# EAGLE schematic HSI-interface-1 (EAGLE 7.6.0)

## Sheet 1 of 3
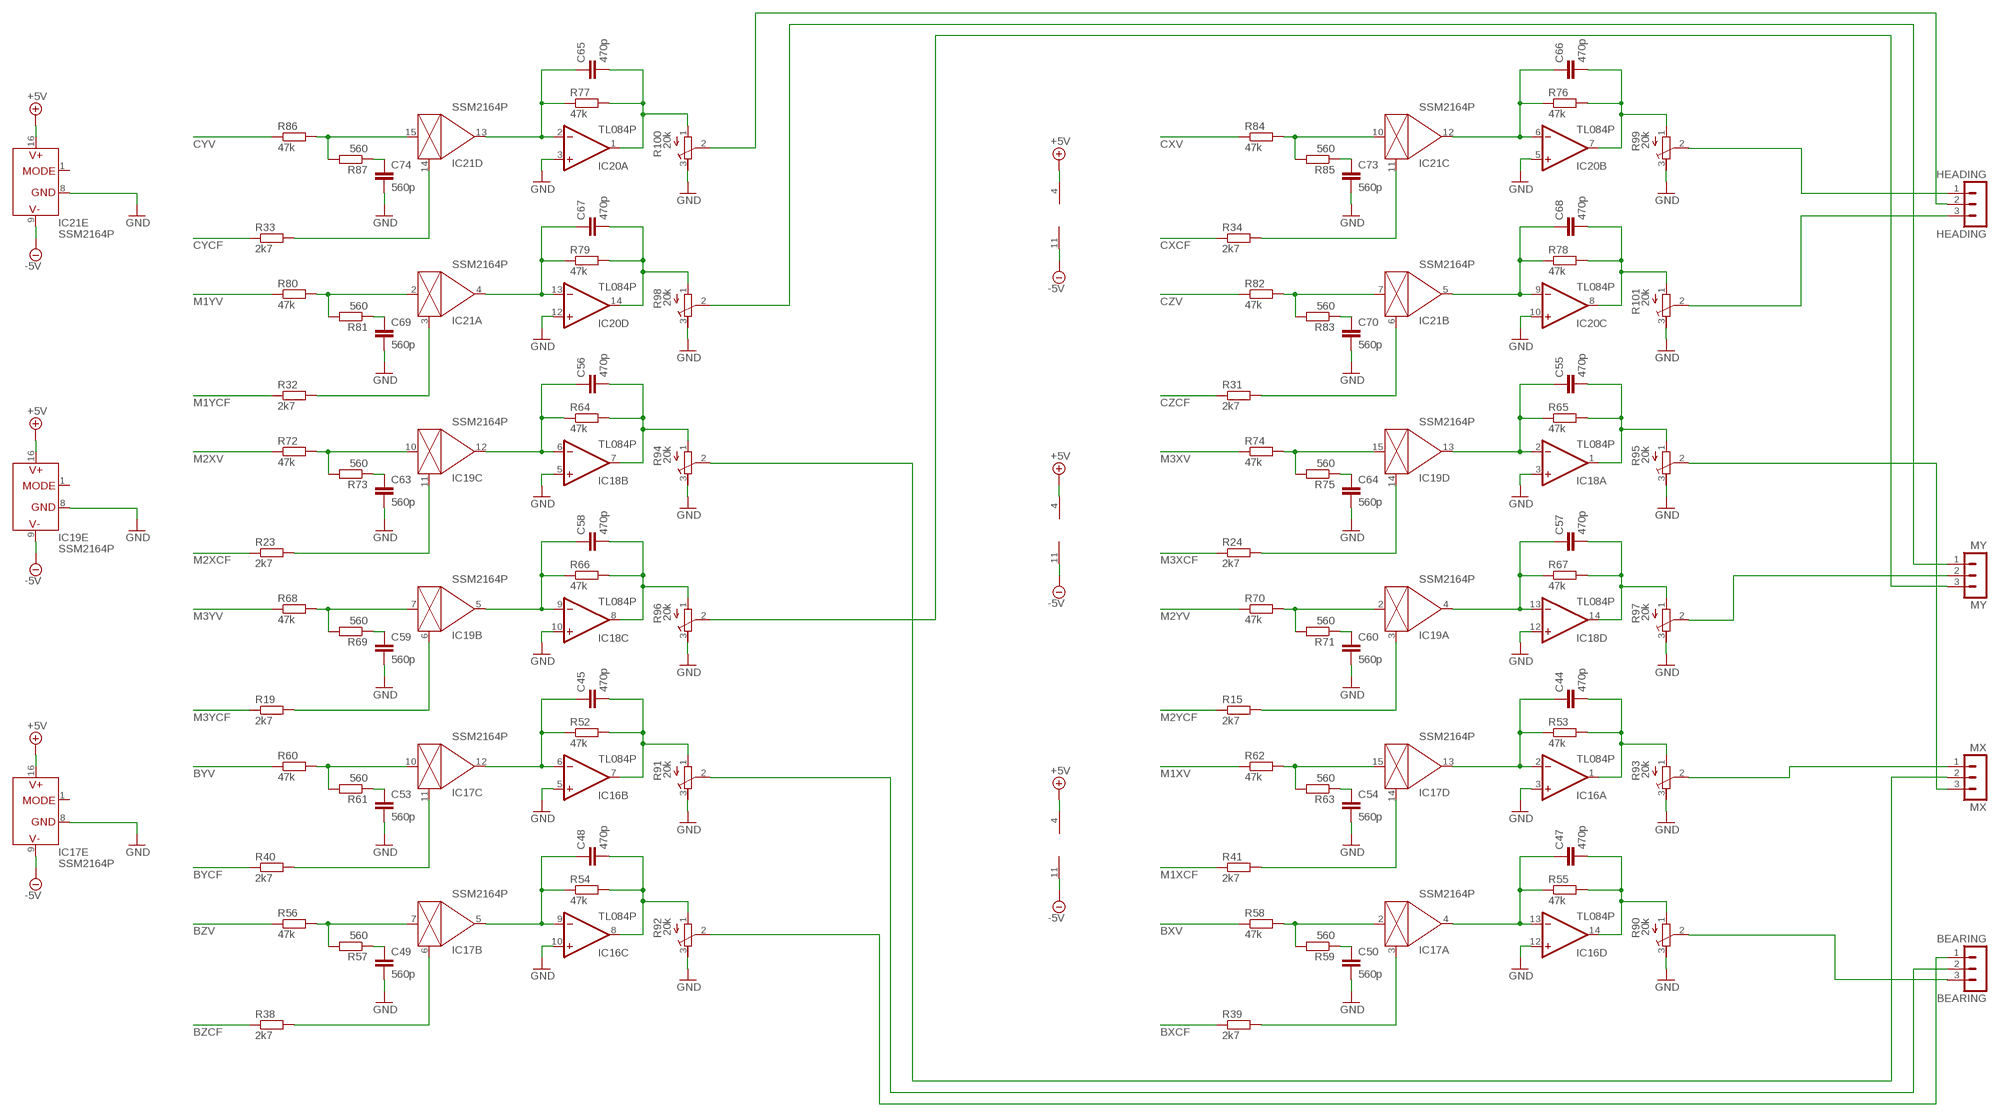
[diagram p0: schematic, sheet 1]

### Parts
BEARING  BEARING  MA03-1  [MA03-1]
C44  470p  C-EU025-025X050  [C025-025X050]
C45  470p  C-EU025-025X050  [C025-025X050]
C47  470p  C-EU025-025X050  [C025-025X050]
C48  470p  C-EU025-025X050  [C025-025X050]
C49  560p  C-EU025-025X050  [C025-025X050]
C50  560p  C-EU025-025X050  [C025-025X050]
C53  560p  C-EU025-025X050  [C025-025X050]
C54  560p  C-EU025-025X050  [C025-025X050]
C55  470p  C-EU025-025X050  [C025-025X050]
C56  470p  C-EU025-025X050  [C025-025X050]
C57  470p  C-EU025-025X050  [C025-025X050]
C58  470p  C-EU025-025X050  [C025-025X050]
C59  560p  C-EU025-025X050  [C025-025X050]
C60  560p  C-EU025-025X050  [C025-025X050]
C63  560p  C-EU025-025X050  [C025-025X050]
C64  560p  C-EU025-025X050  [C025-025X050]
C65  470p  C-EU025-025X050  [C025-025X050]
C66  470p  C-EU025-025X050  [C025-025X050]
C67  470p  C-EU025-025X050  [C025-025X050]
C68  470p  C-EU025-025X050  [C025-025X050]
C69  560p  C-EU025-025X050  [C025-025X050]
C70  560p  C-EU025-025X050  [C025-025X050]
C73  560p  C-EU025-025X050  [C025-025X050]
C74  560p  C-EU025-025X050  [C025-025X050]
HEADING  HEADING  MA03-1  [MA03-1]
IC16  TL084P  [DIL14]
IC17  SSM2164P  [DIL16]
IC18  TL084P  [DIL14]
IC19  SSM2164P  [DIL16]
IC20  TL084P  [DIL14]
IC21  SSM2164P  [DIL16]
MX  MX  MA03-1  [MA03-1]
MY  MY  MA03-1  [MA03-1]
R15  2k7  R-EU_0207/7  [0207/7]
R19  2k7  R-EU_0207/7  [0207/7]
R23  2k7  R-EU_0207/7  [0207/7]
R24  2k7  R-EU_0207/7  [0207/7]
R31  2k7  R-EU_0207/7  [0207/7]
R32  2k7  R-EU_0207/7  [0207/7]
R33  2k7  R-EU_0207/7  [0207/7]
R34  2k7  R-EU_0207/7  [0207/7]
R38  2k7  R-EU_0207/7  [0207/7]
R39  2k7  R-EU_0207/7  [0207/7]
R40  2k7  R-EU_0207/7  [0207/7]
R41  2k7  R-EU_0207/7  [0207/7]
R52  47k  R-EU_0207/7  [0207/7]
R53  47k  R-EU_0207/7  [0207/7]
R54  47k  R-EU_0207/7  [0207/7]
R55  47k  R-EU_0207/7  [0207/7]
R56  47k  R-EU_0207/7  [0207/7]
R57  560  R-EU_0207/7  [0207/7]
R58  47k  R-EU_0207/7  [0207/7]
R59  560  R-EU_0207/7  [0207/7]
R60  47k  R-EU_0207/7  [0207/7]
R61  560  R-EU_0207/7  [0207/7]
R62  47k  R-EU_0207/7  [0207/7]
R63  560  R-EU_0207/7  [0207/7]
R64  47k  R-EU_0207/7  [0207/7]
R65  47k  R-EU_0207/7  [0207/7]
R66  47k  R-EU_0207/7  [0207/7]
R67  47k  R-EU_0207/7  [0207/7]
R68  47k  R-EU_0207/7  [0207/7]
R69  560  R-EU_0207/7  [0207/7]
R70  47k  R-EU_0207/7  [0207/7]
R71  560  R-EU_0207/7  [0207/7]
R72  47k  R-EU_0207/7  [0207/7]
R73  560  R-EU_0207/7  [0207/7]
R74  47k  R-EU_0207/7  [0207/7]
R75  560  R-EU_0207/7  [0207/7]
R76  47k  R-EU_0207/7  [0207/7]
R77  47k  R-EU_0207/7  [0207/7]
R78  47k  R-EU_0207/7  [0207/7]
R79  47k  R-EU_0207/7  [0207/7]
R80  47k  R-EU_0207/7  [0207/7]
R81  560  R-EU_0207/7  [0207/7]
R82  47k  R-EU_0207/7  [0207/7]
R83  560  R-EU_0207/7  [0207/7]
R84  47k  R-EU_0207/7  [0207/7]
R85  560  R-EU_0207/7  [0207/7]
R86  47k  R-EU_0207/7  [0207/7]
R87  560  R-EU_0207/7  [0207/7]
R90  20k  R-TRIMM64Z  [RTRIM64Z]
R91  20k  R-TRIMM64Z  [RTRIM64Z]
R92  20k  R-TRIMM64Z  [RTRIM64Z]
R93  20k  R-TRIMM64Z  [RTRIM64Z]
R94  20k  R-TRIMM64Z  [RTRIM64Z]
R95  20k  R-TRIMM64Z  [RTRIM64Z]
R96  20k  R-TRIMM64Z  [RTRIM64Z]
R97  20k  R-TRIMM64Z  [RTRIM64Z]
R98  20k  R-TRIMM64Z  [RTRIM64Z]
R99  20k  R-TRIMM64Z  [RTRIM64Z]
R100  20k  R-TRIMM64Z  [RTRIM64Z]
R101  20k  R-TRIMM64Z  [RTRIM64Z]

### Nets
+5V [+5V]: IC16.4(P:V+) IC17.16(E:V+) IC18.4(P:V+) IC19.16(E:V+) IC20.4(P:V+) IC21.16(E:V+) ; also sheet 2,3
-5V [-5V]: IC16.11(P:V-) IC17.9(E:V-) IC18.11(P:V-) IC19.9(E:V-) IC20.11(P:V-) IC21.9(E:V-) ; also sheet 2,3
BXCF: R39.1 ; also sheet 3
BXV: R58.1 ; also sheet 2
BYCF: R40.1 ; also sheet 3
BYV: R60.1 ; also sheet 2
BZCF: R38.1 ; also sheet 3
BZV: R56.1 ; also sheet 2
CXCF: R34.1 ; also sheet 3
CXV: R84.1 ; also sheet 2
CYCF: R33.1 ; also sheet 3
CYV: R86.1 ; also sheet 2
CZCF: R31.1 ; also sheet 3
CZV: R82.1 ; also sheet 2
GND [ground]: C49.2 C50.2 C53.2 C54.2 C59.2 C60.2 C63.2 C64.2 C69.2 C70.2 C73.2 C74.2 IC16.3(A:+IN) IC16.5(B:+IN) IC16.10(C:+IN) IC16.12(D:+IN) IC17.8(E:GND) IC18.3(A:+IN) IC18.5(B:+IN) IC18.10(C:+IN) IC18.12(D:+IN) IC19.8(E:GND) IC20.3(A:+IN) IC20.5(B:+IN) IC20.10(C:+IN) IC20.12(D:+IN) IC21.8(E:GND) R90.3(A) R91.3(A) R92.3(A) R93.3(A) R94.3(A) R95.3(A) R96.3(A) R97.3(A) R98.3(A) R99.3(A) R100.3(A) R101.3(A) ; also sheet 2,3
M1XCF: R41.1 ; also sheet 3
M1XV: R62.1 ; also sheet 2
M1YCF: R32.1 ; also sheet 3
M1YV: R80.1 ; also sheet 2
M2XCF: R23.1 ; also sheet 3
M2XV: R72.1 ; also sheet 2
M2YCF: R15.1 ; also sheet 3
M2YV: R70.1 ; also sheet 2
M3XCF: R24.1 ; also sheet 3
M3XV: R74.1 ; also sheet 2
M3YCF: R19.1 ; also sheet 3
M3YV: R68.1 ; also sheet 2
N$4: IC21.3(A:CTRL) R32.2
N$8: IC21.14(D:CTRL) R33.2
N$12: IC19.11(C:CTRL) R23.2
N$16: IC19.6(B:CTRL) R19.2
N$20: IC17.11(C:CTRL) R40.2
N$24: IC17.6(B:CTRL) R38.2
N$28: IC21.11(C:CTRL) R34.2
N$32: IC21.6(B:CTRL) R31.2
N$36: IC19.14(D:CTRL) R24.2
N$40: IC19.3(A:CTRL) R15.2
N$44: IC17.14(D:CTRL) R41.2
N$48: IC17.3(A:CTRL) R39.2
N$49: IC21.10(C:IN) R84.2 R85.2
N$50: C73.1 R85.1
N$51: IC21.15(D:IN) R86.2 R87.2
N$52: C74.1 R87.1
N$53: IC21.7(B:IN) R82.2 R83.2
N$54: C70.1 R83.1
N$55: IC21.2(A:IN) R80.2 R81.2
N$56: C69.1 R81.1
N$57: C67.1 IC20.13(D:-IN) IC21.4(A:OUT) R79.1
N$59: C65.1 IC20.2(A:-IN) IC21.13(D:OUT) R77.1
N$62: C66.1 IC20.6(B:-IN) IC21.12(C:OUT) R76.1
N$63: C68.1 IC20.9(C:-IN) IC21.5(B:OUT) R78.1
N$64: C66.2 IC20.7(B:OUT) R76.2 R99.1(E)
N$65: C65.2 IC20.1(A:OUT) R77.2 R100.1(E)
N$66: C68.2 IC20.8(C:OUT) R78.2 R101.1(E)
N$67: C67.2 IC20.14(D:OUT) R79.2 R98.1(E)
N$68: IC19.10(C:IN) R72.2 R73.2
N$69: C63.1 R73.1
N$70: IC19.15(D:IN) R74.2 R75.2
N$71: C64.1 R75.1
N$72: IC19.2(A:IN) R70.2 R71.2
N$73: C60.1 R71.1
N$74: IC19.7(B:IN) R68.2 R69.2
N$75: C59.1 R69.1
N$76: C57.1 IC18.13(D:-IN) IC19.4(A:OUT) R67.1
N$77: C58.1 IC18.9(C:-IN) IC19.5(B:OUT) R66.1
N$78: C55.1 IC18.2(A:-IN) IC19.13(D:OUT) R65.1
N$79: C56.1 IC18.6(B:-IN) IC19.12(C:OUT) R64.1
N$80: C58.2 IC18.8(C:OUT) R66.2 R96.1(E)
N$81: C57.2 IC18.14(D:OUT) R67.2 R97.1(E)
N$82: C56.2 IC18.7(B:OUT) R64.2 R94.1(E)
N$83: C55.2 IC18.1(A:OUT) R65.2 R95.1(E)
N$103: HEADING.1 R99.2(S)
N$104: HEADING.3 R101.2(S)
N$105: HEADING.2 R100.2(S)
N$107: MY.1 R98.2(S)
N$110: MY.3 R96.2(S)
N$111: MY.2 R97.2(S)
N$113: MX.3 R95.2(S)
N$119: MX.2 R94.2(S)
N$120: IC17.10(C:IN) R60.2 R61.2
N$121: C53.1 R61.1
N$122: IC17.15(D:IN) R62.2 R63.2
N$123: C54.1 R63.1
N$124: IC17.2(A:IN) R58.2 R59.2
N$125: C50.1 R59.1
N$126: IC17.7(B:IN) R56.2 R57.2
N$127: C49.1 R57.1
N$130: C44.1 IC16.2(A:-IN) IC17.13(D:OUT) R53.1
N$131: C47.1 IC16.13(D:-IN) IC17.4(A:OUT) R55.1
N$133: MX.1 R93.2(S)
N$134: C45.1 IC16.6(B:-IN) IC17.12(C:OUT) R52.1
N$135: C48.1 IC16.9(C:-IN) IC17.5(B:OUT) R54.1
N$136: C45.2 IC16.7(B:OUT) R52.2 R91.1(E)
N$137: C44.2 IC16.1(A:OUT) R53.2 R93.1(E)
N$138: C48.2 IC16.8(C:OUT) R54.2 R92.1(E)
N$139: C47.2 IC16.14(D:OUT) R55.2 R90.1(E)
N$140: BEARING.3 R90.2(S)
N$144: BEARING.1 R92.2(S)
N$147: BEARING.2 R91.2(S)
Unconnected: IC17.1(E:MODE) IC19.1(E:MODE) IC21.1(E:MODE)

## Sheet 2 of 3
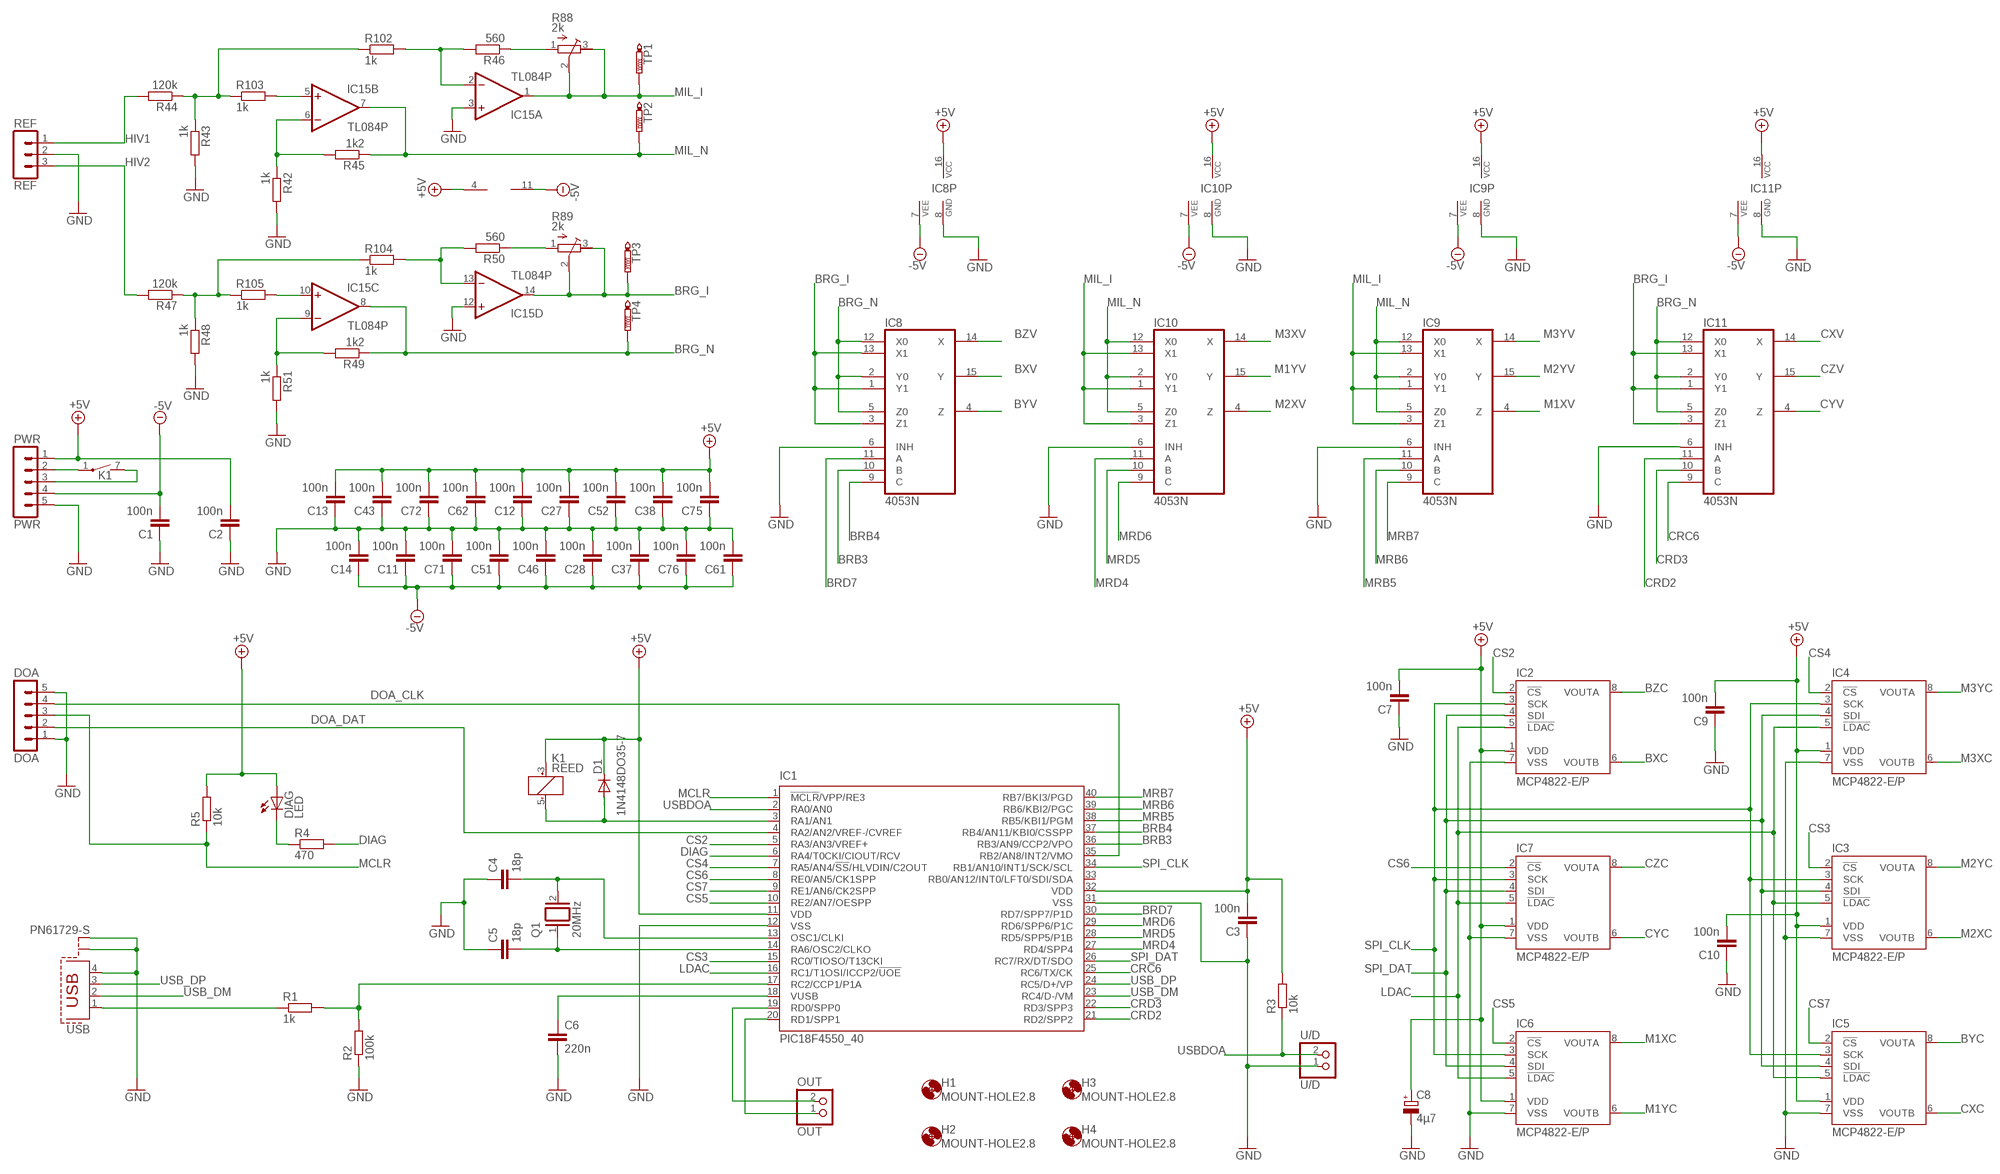
[diagram p1: schematic, sheet 2]

### Parts
C1  100n  C-EU025-025X050  [C025-025X050]
C2  100n  C-EU025-025X050  [C025-025X050]
C3  100n  C-EU025-025X050  [C025-025X050]
C4  18p  C-EU025-025X050  [C025-025X050]
C5  18p  C-EU025-025X050  [C025-025X050]
C6  220n  C5/3  [C5B3]
C7  100n  C-EU025-025X050  [C025-025X050]
C8  4µ7  CPOL-EUE2.5-5  [E2,5-5]
C9  100n  C-EU025-025X050  [C025-025X050]
C10  100n  C-EU025-025X050  [C025-025X050]
C11  100n  C-EU025-025X050  [C025-025X050]
C12  100n  C-EU025-025X050  [C025-025X050]
C13  100n  C-EU025-025X050  [C025-025X050]
C14  100n  C-EU025-025X050  [C025-025X050]
C27  100n  C-EU025-025X050  [C025-025X050]
C28  100n  C-EU025-025X050  [C025-025X050]
C37  100n  C-EU025-025X050  [C025-025X050]
C38  100n  C-EU025-025X050  [C025-025X050]
C43  100n  C-EU025-025X050  [C025-025X050]
C46  100n  C-EU025-025X050  [C025-025X050]
C51  100n  C-EU025-025X050  [C025-025X050]
C52  100n  C-EU025-025X050  [C025-025X050]
C61  100n  C-EU025-025X050  [C025-025X050]
C62  100n  C-EU025-025X050  [C025-025X050]
C71  100n  C-EU025-025X050  [C025-025X050]
C72  100n  C-EU025-025X050  [C025-025X050]
C75  100n  C-EU025-025X050  [C025-025X050]
C76  100n  C-EU025-025X050  [C025-025X050]
D1  1N4148DO35-7  [DO35-7]
DIAG  LED  LED3MM  [LED3MM]
DOA  DOA  MA05-1  [MA05-1]
H1  MOUNT-HOLE2.8  [2,8]
H2  MOUNT-HOLE2.8  [2,8]
H3  MOUNT-HOLE2.8  [2,8]
H4  MOUNT-HOLE2.8  [2,8]
IC1  PIC18F4550_40  [DIL40]
IC2  MCP4822-E/P  [DIL08]
IC3  MCP4822-E/P  [DIL08]
IC4  MCP4822-E/P  [DIL08]
IC5  MCP4822-E/P  [DIL08]
IC6  MCP4822-E/P  [DIL08]
IC7  MCP4822-E/P  [DIL08]
IC8  4053N  [DIL16]
IC9  4053N  [DIL16]
IC10  4053N  [DIL16]
IC11  4053N  [DIL16]
IC15  TL084P  [DIL14]
K1  REED  [REED]
OUT  OUT  PINHD-1X2  [1X02]
PWR  PWR  MA05-1  [MA05-1]
Q1  20MHz  XTAL/S  [QS]
R1  1k  R-EU_0204/7  [0204/7]
R2  100k  R-EU_0204/7  [0204/7]
R3  10k  R-EU_0204/7  [0204/7]
R4  470  R-EU_0204/7  [0204/7]
R5  10k  R-EU_0204/7  [0204/7]
R42  1k  R-EU_0204/7  [0204/7]
R43  1k  R-EU_0204/7  [0204/7]
R44  120k  R-EU_0204/7  [0204/7]
R45  1k2  R-EU_0204/7  [0204/7]
R46  560  R-EU_0204/7  [0204/7]
R47  120k  R-EU_0204/7  [0204/7]
R48  1k  R-EU_0204/7  [0204/7]
R49  1k2  R-EU_0204/7  [0204/7]
R50  560  R-EU_0204/7  [0204/7]
R51  1k  R-EU_0204/7  [0204/7]
R88  2k  R-TRIMM64Z  [RTRIM64Z]
R89  2k  R-TRIMM64Z  [RTRIM64Z]
R102  1k  R-EU_0204/7  [0204/7]
R103  1k  R-EU_0204/7  [0204/7]
R104  1k  R-EU_0204/7  [0204/7]
R105  1k  R-EU_0204/7  [0204/7]
REF  REF  MA03-1  [MA03-1]
TP1  PTR1PAD1-13  [P1-13]
TP2  PTR1PAD1-13  [P1-13]
TP3  PTR1PAD1-13  [P1-13]
TP4  PTR1PAD1-13  [P1-13]
U/D  U/D  PINHD-1X2  [1X02]
USB  PN61729-S  [PN61729-S]

### Nets
+5V [+5V]: C2.2 C3.2 C7.2 C8.+ C9.2 C10.2 C12.2 C13.2 C27.2 C38.2 C43.2 C52.2 C62.2 C72.2 C75.2 D1.C DIAG.A IC1.11(VDD) IC1.32(VDD) IC2.1(VDD) IC3.1(VDD) IC4.1(VDD) IC5.1(VDD) IC6.1(VDD) IC7.1(VDD) IC8.16(VCC) IC9.16(VCC) IC10.16(VCC) IC11.16(VCC) IC15.4(P:V+) K1.3(1:+) PWR.1 R3.2 R5.2 ; also sheet 1,3
-5V [-5V]: C1.2 C11.1 C14.1 C28.1 C37.1 C46.1 C51.1 C61.1 C71.1 C76.1 IC8.7(VEE) IC9.7(VEE) IC10.7(VEE) IC11.7(VEE) IC15.11(P:V-) PWR.4 ; also sheet 1,3
BRB3: IC1.36(RB3/AN9/CCP2/VPO) IC8.10(B)
BRB4: IC1.37(RB4/AN11/KBI0/CSSPP) IC8.9(C)
BRD7: IC1.30(RD7/SPP7/P1D) IC8.11(A)
BRG_I: IC8.1(Y1) IC8.3(Z1) IC8.13(X1) IC11.1(Y1) IC11.3(Z1) IC11.13(X1) IC15.14(D:OUT) R89.2(S) R89.3(A) TP3.TP
BRG_N: IC8.2(Y0) IC8.5(Z0) IC8.12(X0) IC11.2(Y0) IC11.5(Z0) IC11.12(X0) IC15.8(C:OUT) R49.1 TP4.TP
BXC: IC2.6(VOUTB) ; also sheet 3
BXV: IC8.15(Y) ; also sheet 1
BYC: IC5.8(VOUTA) ; also sheet 3
BYV: IC8.4(Z) ; also sheet 1
BZC: IC2.8(VOUTA) ; also sheet 3
BZV: IC8.14(X) ; also sheet 1
CRC6: IC1.25(RC6/TX/CK) IC11.9(C)
CRD2: IC1.21(RD2/SPP2) IC11.11(A)
CRD3: IC1.22(RD3/SPP3) IC11.10(B)
CS2: IC1.5(RA3/AN3/VREF+) IC2.2(!CS)
CS3: IC1.15(RC0/TIOSO/T13CKI) IC3.2(!CS)
CS4: IC1.7(RA5/AN4/!SS!/HLVDIN/C2OUT) IC4.2(!CS)
CS5: IC1.10(RE2/AN7/OESPP) IC6.2(!CS)
CS6: IC1.8(RE0/AN5/CK1SPP) IC7.2(!CS)
CS7: IC1.9(RE1/AN6/CK2SPP) IC5.2(!CS)
CXC: IC5.6(VOUTB) ; also sheet 3
CXV: IC11.14(X) ; also sheet 1
CYC: IC7.6(VOUTB) ; also sheet 3
CYV: IC11.4(Z) ; also sheet 1
CZC: IC7.8(VOUTA) ; also sheet 3
CZV: IC11.15(Y) ; also sheet 1
DIAG: IC1.6(RA4/T0CKI/CIOUT/RCV) R4.2
DOA_CLK: DOA.4 IC1.35(RB2/AN8/INT2/VMO)
DOA_DAT: DOA.2 IC1.4(RA2/AN2/VREF-/CVREF)
GND [ground]: C1.1 C2.1 C3.1 C4.1 C5.1 C6.2 C7.1 C8.- C9.1 C10.1 C11.2 C12.1 C13.1 C14.2 C27.1 C28.2 C37.2 C38.1 C43.1 C46.2 C51.2 C52.1 C61.2 C62.1 C71.2 C72.1 C75.1 C76.2 DOA.1 DOA.5 IC1.12(VSS) IC1.31(VSS) IC2.7(VSS) IC3.7(VSS) IC4.7(VSS) IC5.7(VSS) IC6.7(VSS) IC7.7(VSS) IC8.6(INH) IC8.8(GND) IC9.6(INH) IC9.8(GND) IC10.6(INH) IC10.8(GND) IC11.6(INH) IC11.8(GND) IC15.3(A:+IN) IC15.12(D:+IN) PWR.5 R2.1 R42.2 R43.2 R48.2 R51.2 REF.2 U/D.1 USB.4 USB.S1 USB.S2 ; also sheet 1,3
HIV1: R44.2 REF.1
HIV2: R47.2 REF.3
LDAC: IC1.16(RC1/T1OSI/ICCP2/!UOE) IC2.5(!LDAC) IC3.5(!LDAC) IC4.5(!LDAC) IC5.5(!LDAC) IC6.5(!LDAC) IC7.5(!LDAC)
M1XC: IC6.8(VOUTA) ; also sheet 3
M1XV: IC9.4(Z) ; also sheet 1
M1YC: IC6.6(VOUTB) ; also sheet 3
M1YV: IC10.15(Y) ; also sheet 1
M2XC: IC3.6(VOUTB) ; also sheet 3
M2XV: IC10.4(Z) ; also sheet 1
M2YC: IC3.8(VOUTA) ; also sheet 3
M2YV: IC9.15(Y) ; also sheet 1
M3XC: IC4.6(VOUTB) ; also sheet 3
M3XV: IC10.14(X) ; also sheet 1
M3YC: IC4.8(VOUTA) ; also sheet 3
M3YV: IC9.14(X) ; also sheet 1
MCLR: DOA.3 IC1.1(!MCLR!/VPP/RE3) R5.1
MIL_I: IC9.1(Y1) IC9.3(Z1) IC9.13(X1) IC10.1(Y1) IC10.3(Z1) IC10.13(X1) IC15.1(A:OUT) R88.2(S) R88.3(A) TP1.TP
MIL_N: IC9.2(Y0) IC9.5(Z0) IC9.12(X0) IC10.2(Y0) IC10.5(Z0) IC10.12(X0) IC15.7(B:OUT) R45.1 TP2.TP
MRB5: IC1.38(RB5/KBI1/PGM) IC9.11(A)
MRB6: IC1.39(RB6/KBI2/PGC) IC9.10(B)
MRB7: IC1.40(RB7/BKI3/PGD) IC9.9(C)
MRD4: IC1.27(RD4/SPP4) IC10.11(A)
MRD5: IC1.28(RD5/SPP5/P1B) IC10.10(B)
MRD6: IC1.29(RD6/SPP6/P1C) IC10.9(C)
N$1: IC1.20(RD1/SPP1) OUT.1
N$2: IC1.19(RD0/SPP0) OUT.2
N$6: IC15.6(B:-IN) R42.1 R45.2
N$10: IC15.2(A:-IN) R46.2 R102.2
N$14: IC15.5(B:+IN) R103.2
N$15: R50.1 R89.1(E)
N$19: R43.1 R44.1 R102.1 R103.1
N$21: R46.1 R88.1(E)
N$22: D1.A IC1.3(RA1/AN1) K1.5(1:-)
N$23: R47.1 R48.1 R104.1 R105.1
N$35: IC15.13(D:-IN) R50.2 R104.2
N$41: IC15.10(C:+IN) R105.2
N$46: IC15.9(C:-IN) R49.2 R51.1
N$58: R1.1 USB.1
N$60: IC1.17(RC2/CCP1/P1A) R1.2 R2.2
N$61: C5.2 IC1.14(RA6/OSC2/CLKO) Q1.1
N$84: C4.2 IC1.13(OSC1/CLKI) Q1.2
N$85: K1.1(2:P) PWR.2
N$86: K1.7(2:S) PWR.3
N$88: DIAG.K(C) R4.1
N$96: C6.1 IC1.18(VUSB)
SPI_CLK: IC1.34(RB1/AN10/INT1/SCK/SCL) IC2.3(SCK) IC3.3(SCK) IC4.3(SCK) IC5.3(SCK) IC6.3(SCK) IC7.3(SCK)
SPI_DAT: IC1.26(RC7/RX/DT/SDO) IC2.4(SDI) IC3.4(SDI) IC4.4(SDI) IC5.4(SDI) IC6.4(SDI) IC7.4(SDI)
USB_DM: IC1.23(RC4/D-/VM) USB.2
USB_DP: IC1.24(RC5/D+/VP) USB.3
USBDOA: IC1.2(RA0/AN0) R3.1 U/D.2
Unconnected: IC1.33(RB0/AN12/INT0/LFT0/SDI/SDA)

## Sheet 3 of 3
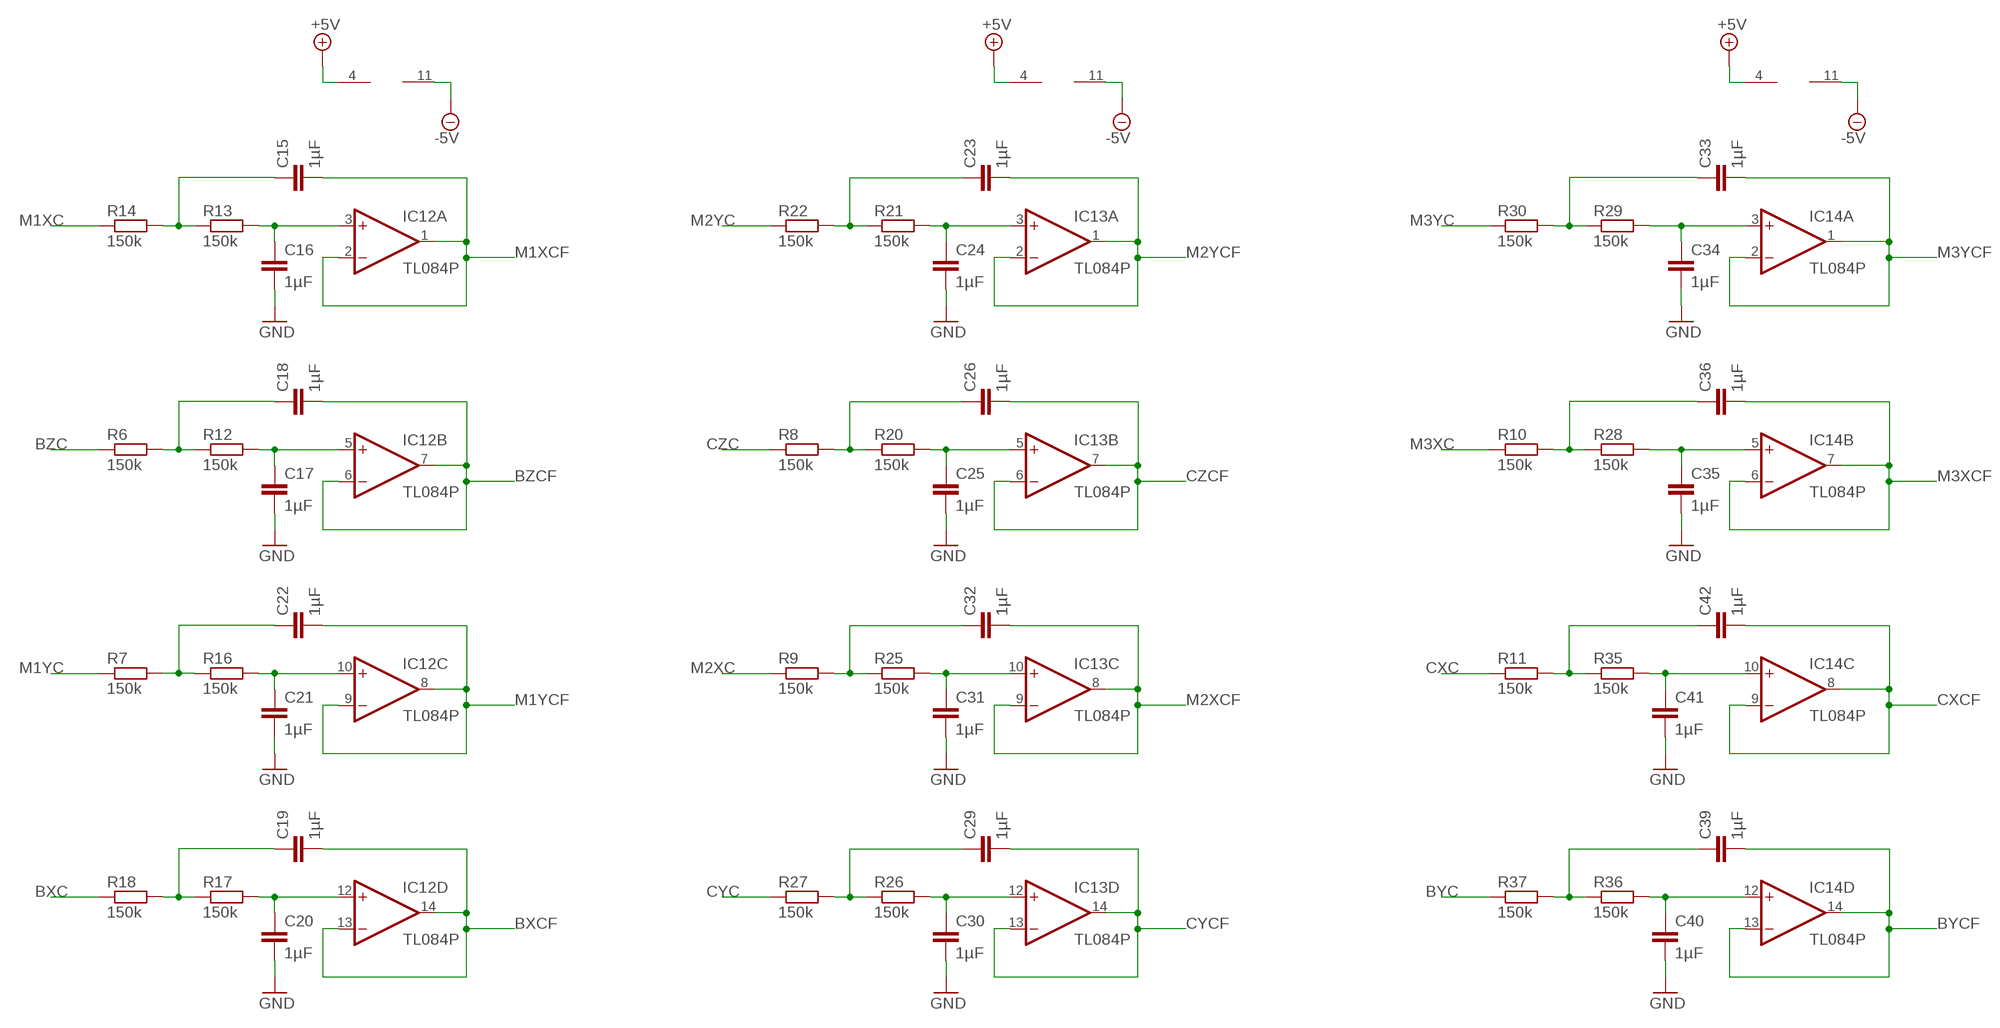
[diagram p2: schematic, sheet 3]

### Parts
C15  1µF  C-EU025-025X050  [C025-025X050]
C16  1µF  C-EU025-025X050  [C025-025X050]
C17  1µF  C-EU025-025X050  [C025-025X050]
C18  1µF  C-EU025-025X050  [C025-025X050]
C19  1µF  C-EU025-025X050  [C025-025X050]
C20  1µF  C-EU025-025X050  [C025-025X050]
C21  1µF  C-EU025-025X050  [C025-025X050]
C22  1µF  C-EU025-025X050  [C025-025X050]
C23  1µF  C-EU025-025X050  [C025-025X050]
C24  1µF  C-EU025-025X050  [C025-025X050]
C25  1µF  C-EU025-025X050  [C025-025X050]
C26  1µF  C-EU025-025X050  [C025-025X050]
C29  1µF  C-EU025-025X050  [C025-025X050]
C30  1µF  C-EU025-025X050  [C025-025X050]
C31  1µF  C-EU025-025X050  [C025-025X050]
C32  1µF  C-EU025-025X050  [C025-025X050]
C33  1µF  C-EU025-025X050  [C025-025X050]
C34  1µF  C-EU025-025X050  [C025-025X050]
C35  1µF  C-EU025-025X050  [C025-025X050]
C36  1µF  C-EU025-025X050  [C025-025X050]
C39  1µF  C-EU025-025X050  [C025-025X050]
C40  1µF  C-EU025-025X050  [C025-025X050]
C41  1µF  C-EU025-025X050  [C025-025X050]
C42  1µF  C-EU025-025X050  [C025-025X050]
IC12  TL084P  [DIL14]
IC13  TL084P  [DIL14]
IC14  TL084P  [DIL14]
R6  150k  R-EU_0207/7  [0207/7]
R7  150k  R-EU_0207/7  [0207/7]
R8  150k  R-EU_0207/7  [0207/7]
R9  150k  R-EU_0207/7  [0207/7]
R10  150k  R-EU_0207/7  [0207/7]
R11  150k  R-EU_0207/7  [0207/7]
R12  150k  R-EU_0207/7  [0207/7]
R13  150k  R-EU_0207/7  [0207/7]
R14  150k  R-EU_0207/7  [0207/7]
R16  150k  R-EU_0207/7  [0207/7]
R17  150k  R-EU_0207/7  [0207/7]
R18  150k  R-EU_0207/7  [0207/7]
R20  150k  R-EU_0207/7  [0207/7]
R21  150k  R-EU_0207/7  [0207/7]
R22  150k  R-EU_0207/7  [0207/7]
R25  150k  R-EU_0207/7  [0207/7]
R26  150k  R-EU_0207/7  [0207/7]
R27  150k  R-EU_0207/7  [0207/7]
R28  150k  R-EU_0207/7  [0207/7]
R29  150k  R-EU_0207/7  [0207/7]
R30  150k  R-EU_0207/7  [0207/7]
R35  150k  R-EU_0207/7  [0207/7]
R36  150k  R-EU_0207/7  [0207/7]
R37  150k  R-EU_0207/7  [0207/7]

### Nets
+5V [+5V]: IC12.4(P:V+) IC13.4(P:V+) IC14.4(P:V+) ; also sheet 1,2
-5V [-5V]: IC12.11(P:V-) IC13.11(P:V-) IC14.11(P:V-) ; also sheet 1,2
BXC: R18.1 ; also sheet 2
BXCF: C19.2 IC12.13(D:-IN) IC12.14(D:OUT) ; also sheet 1
BYC: R37.1 ; also sheet 2
BYCF: C39.2 IC14.13(D:-IN) IC14.14(D:OUT) ; also sheet 1
BZC: R6.1 ; also sheet 2
BZCF: C18.2 IC12.6(B:-IN) IC12.7(B:OUT) ; also sheet 1
CXC: R11.1 ; also sheet 2
CXCF: C42.2 IC14.8(C:OUT) IC14.9(C:-IN) ; also sheet 1
CYC: R27.1 ; also sheet 2
CYCF: C29.2 IC13.13(D:-IN) IC13.14(D:OUT) ; also sheet 1
CZC: R8.1 ; also sheet 2
CZCF: C26.2 IC13.6(B:-IN) IC13.7(B:OUT) ; also sheet 1
GND [ground]: C16.2 C17.2 C20.2 C21.2 C24.2 C25.2 C30.2 C31.2 C34.2 C35.2 C40.2 C41.2 ; also sheet 1,2
M1XC: R14.1 ; also sheet 2
M1XCF: C15.2 IC12.1(A:OUT) IC12.2(A:-IN) ; also sheet 1
M1YC: R7.1 ; also sheet 2
M1YCF: C22.2 IC12.8(C:OUT) IC12.9(C:-IN) ; also sheet 1
M2XC: R9.1 ; also sheet 2
M2XCF: C32.2 IC13.8(C:OUT) IC13.9(C:-IN) ; also sheet 1
M2YC: R22.1 ; also sheet 2
M2YCF: C23.2 IC13.1(A:OUT) IC13.2(A:-IN) ; also sheet 1
M3XC: R10.1 ; also sheet 2
M3XCF: C36.2 IC14.6(B:-IN) IC14.7(B:OUT) ; also sheet 1
M3YC: R30.1 ; also sheet 2
M3YCF: C33.2 IC14.1(A:OUT) IC14.2(A:-IN) ; also sheet 1
N$3: C15.1 R13.1 R14.2
N$5: C16.1 IC12.3(A:+IN) R13.2
N$7: C18.1 R6.2 R12.1
N$9: C17.1 IC12.5(B:+IN) R12.2
N$11: C21.1 IC12.10(C:+IN) R16.2
N$13: C22.1 R7.2 R16.1
N$17: C19.1 R17.1 R18.2
N$18: C20.1 IC12.12(D:+IN) R17.2
N$25: C33.1 R29.1 R30.2
N$26: C34.1 IC14.3(A:+IN) R29.2
N$27: C36.1 R10.2 R28.1
N$29: C35.1 IC14.5(B:+IN) R28.2
N$30: C42.1 R11.2 R35.1
N$31: C41.1 IC14.10(C:+IN) R35.2
N$33: C39.1 R36.1 R37.2
N$34: C40.1 IC14.12(D:+IN) R36.2
N$37: C24.1 IC13.3(A:+IN) R21.2
N$38: C23.1 R21.1 R22.2
N$39: C26.1 R8.2 R20.1
N$42: C25.1 IC13.5(B:+IN) R20.2
N$43: C32.1 R9.2 R25.1
N$45: C31.1 IC13.10(C:+IN) R25.2
N$97: C30.1 IC13.12(D:+IN) R26.2
N$98: C29.1 R26.1 R27.2

## Library data of the parts
BEARING HEADING MX MY REF = con-lstb:MA03-1: PIN HEADER; OC_FARNELL: unknown; OC_NEWARK: unknown
C1-C5 C7 C9-C76 = rcl:C-EU: CAPACITOR, European symbol
C6 = capacitor-wima:C: CAPACITOR naming: grid - package width
C8 = rcl:CPOL-EU: POLARIZED CAPACITOR, European symbol
D1 = diode:1N4148: DIODE high speed (Philips)
DIAG = henk:LED: LEDs Standard schematic elements and footprints for 5mm, 3mm, 1206, and 0603 sized LEDs. 5mm - Spark Fun Electronics SKU : COM-00529 (and others)
DOA PWR = con-lstb:MA05-1: PIN HEADER; OC_FARNELL: unknown; OC_NEWARK: unknown
H1-H4 = holes:MOUNT-HOLE: MOUNTING HOLE with drill center marker
IC1 = microchip:PIC18F4*_40: USB Microcontrollers with nanoWatt Technology High-Performance, Enhanced Flash, 28/40/44-Pin, Source: http://ww1.microchip.com/downloads/en/devicedoc/39632c.pdf; MF: MICROCHIP; MPN: PIC18F4550-I/P; OC_FARNELL: 9321357; OC_NEWARK: 74K8623
IC2-IC7 = nh-ic:MCP4822: Microchip MCP4822 According to datasheet http://ww1.microchip.com/downloads/en/DeviceDoc/22249A.pdf. Created by Nils Hintze <n.hintze@elektronikpage.net>
IC8-IC11 = 40xx:4053: Triple 2-channel ANALOG MULTIPLEXER
IC12-IC16 IC18 IC20 = linear:TL084: OP AMP
IC17 IC19 IC21 = ssm2164:SSM2164
K1 = relay:REED: RELAY reed, 1 x norm. open with polarity, grid 5.08; OC_FARNELL: unknown; OC_NEWARK: unknown
OUT U/D = pinhead:PINHD-1X2: PIN HEADER
Q1 = special:XTAL/S: CRYSTAL
R1-R87 R102-R105 = rcl:R-EU_: RESISTOR, European symbol
R88-R101 = resistor:R-TRIMM: Trimm resistor
TP1-TP4 = testpad:PTR1: TEST PIN
USB = con-berg:PN61729-S: BERG USB connector; OC_FARNELL: unknown; OC_NEWARK: unknown

## Net classes
0 default: width 0.254 mm, drill 0.254 mm, clearance 0.254 mm
1 ground: width 0.508 mm, drill 0.254 mm, clearance 0.254 mm
2 +5V: width 0.381 mm, drill 0.254 mm, clearance 0.254 mm
3 -5V: width 0.381 mm, drill 0.254 mm, clearance 0.254 mm
4 +12V: width 0.381 mm, drill 0.254 mm, clearance 0.254 mm
5 -12V: width 0.381 mm, drill 0.254 mm, clearance 0.254 mm
6 HIV1: width 0.381 mm, drill 0.381 mm, clearance 0.508 mm
7 HIV2: width 0.381 mm, drill 0.381 mm, clearance 0.508 mm